# EAGLE design tick-display-mk-3 (EAGLE 6.5.0)
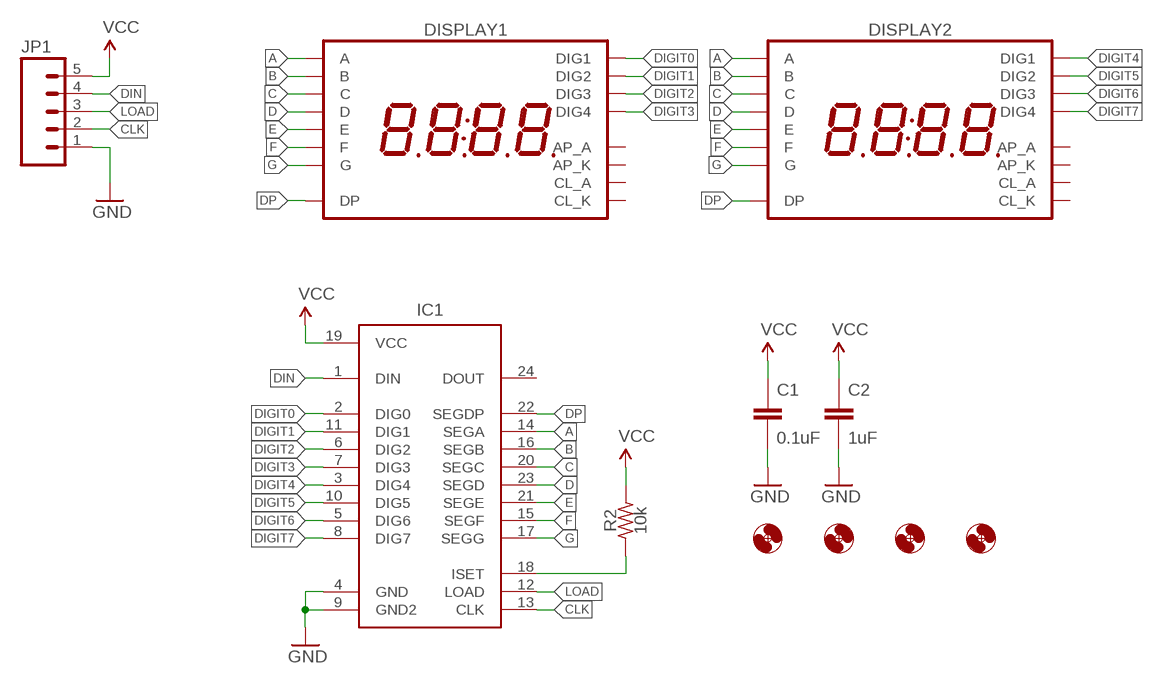
[diagram p0: schematic, sheet 1]

## Parts
C1  0.1uF  CAPACITOR-CERAMICC0805  [C0805]
C2  1uF  CAPACITOR-CERAMICC0805  [C0805]
DISPLAY1  7SEG_4DIGIT_10MM  [7SEG_4DIG_10MM]
DISPLAY2  7SEG_4DIGIT_10MM  [7SEG_4DIG_10MM]
H1  HOLE#2  [HOLE-#2]
H2  HOLE#2  [HOLE-#2]
H3  HOLE#2  [HOLE-#2]
H4  HOLE#2  [HOLE-#2]
IC1  MAX7219CWG  MAX7219SOIC-W  [SO24W]
JP1  M05JST-PH-RA-PTH  [JST-5-PH-RA-PTH]
R2  10k  RESISTORR0805  [R0805]

## Nets
A: DISPLAY1.14(A) DISPLAY2.14(A) IC1.14(SEGA)
B: DISPLAY1.16(B) DISPLAY2.16(B) IC1.16(SEGB)
C: DISPLAY1.13(C) DISPLAY2.13(C) IC1.20(SEGC)
CLK: IC1.13(CLK) JP1.2
D: DISPLAY1.3(D) DISPLAY2.3(D) IC1.23(SEGD)
DIGIT0: DISPLAY1.1(DIG1) IC1.2(DIG0)
DIGIT1: DISPLAY1.2(DIG2) IC1.11(DIG1)
DIGIT2: DISPLAY1.6(DIG3) IC1.6(DIG2)
DIGIT3: DISPLAY1.8(DIG4) IC1.7(DIG3)
DIGIT4: DISPLAY2.1(DIG1) IC1.3(DIG4)
DIGIT5: DISPLAY2.2(DIG2) IC1.10(DIG5)
DIGIT6: DISPLAY2.6(DIG3) IC1.5(DIG6)
DIGIT7: DISPLAY2.8(DIG4) IC1.8(DIG7)
DIN: IC1.1(DIN) JP1.4
DP: DISPLAY1.7(DP) DISPLAY2.7(DP) IC1.22(SEGDP)
E: DISPLAY1.5(E) DISPLAY2.5(E) IC1.21(SEGE)
F: DISPLAY1.11(F) DISPLAY2.11(F) IC1.15(SEGF)
G: DISPLAY1.15(G) DISPLAY2.15(G) IC1.17(SEGG)
GND: C1.2 C2.2 IC1.4(GND) IC1.9(GND2) JP1.1
LOAD: IC1.12(LOAD) JP1.3
N$2: IC1.18(ISET) R2.1
VCC: C1.1 C2.1 IC1.19(VCC) JP1.5 R2.2
Unconnected: DISPLAY1.4(CL_A) DISPLAY1.9(AP_K) DISPLAY1.10(AP_A) DISPLAY1.12(CL_K) DISPLAY2.4(CL_A) DISPLAY2.9(AP_K) DISPLAY2.10(AP_A) DISPLAY2.12(CL_K) IC1.24(DOUT)

## Library data of the parts
C1 C2 = A_butts:CAPACITOR-CERAMIC: CAPACITOR, European symbol
DISPLAY1 DISPLAY2 = A_butts:7SEG_4DIGIT_10MM
H1-H4 = A_butts:HOLE: MOUNTING HOLE with drill center marker
IC1 = A_butts:MAX7219: 8-digit, 8-segment LED display driver, serial input
JP1 = A_butts:M05: Header 5 Standard 5-pin 0.1" header. Use with straight break away headers (SKU : PRT-00116), right angle break away headers (PRT-00553), swiss pins (PRT-00743), machine pins (PRT-00117), and female headers (PRT-00115). Molex polarized connector foot print use with SKU : PRT-08230 with associated crimp pins and housings.
R2 = A_butts:RESISTOR: RESISTOR, American symbol

## Board
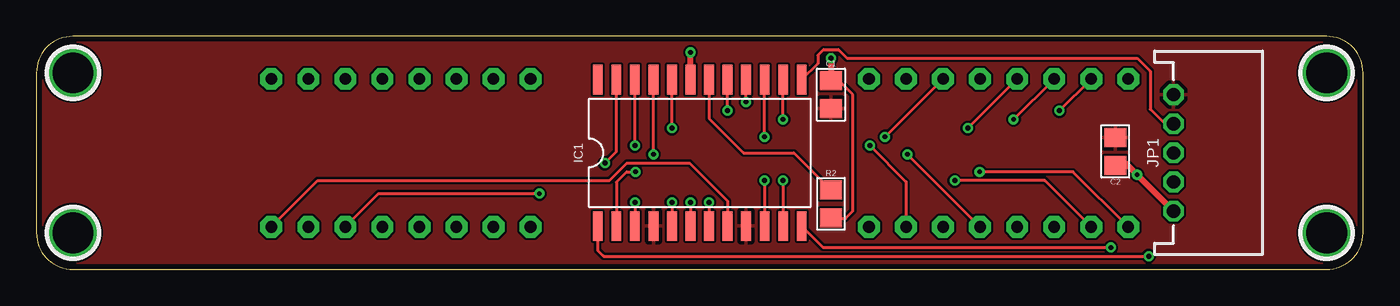
[diagram p1: board, top side]
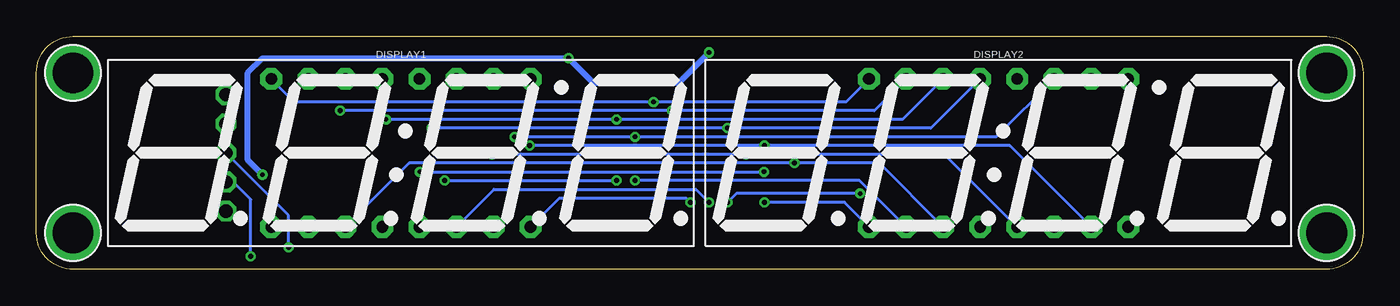
[diagram p2: board, bottom side, seen from below]

Size 91 x 16 mm. Coordinates in mm from the lower left corner, seen from the top.
Outline: 0,13.5 0,2.5 arc90 2.5,0 88.5,0 arc90 91,2.5 91,13.5 arc90 88.5,16 2.5,16 arc90 0,13.5
Copper layers (1*16): Top 0.0356mm / dielectric 1.5011mm / Bottom 0.0356mm
Design rules "LaenPCBOrder2": minimum track width 6mil, minimum drill 13mil, track to track 6mil, track to pad 6mil, pad to pad 6mil, via to via 6mil, smd to smd 6mil, copper to edge 15mil, drill to drill 6mil, minimum pad ring 7mil, minimum via ring 7mil, stop-mask expansion 3mil, vias tented up to drill 20mil, thermal gap 10mil

### Footprints (pad centres in the part's own frame; a part is rotated, then mirrored left to right if it is on the bottom)
C0805 = smd 1.3 x 1.5: 1 -0.95,0; 2 0.95,0
7SEG_4DIG_10MM = drill 0.8 pad 1.5 octagon: 1 -8.89,-5.08; 2 -6.35,-5.08; 3 -3.81,-5.08; 4 -1.27,-5.08; 5 1.27,-5.08; 6 3.81,-5.08; 7 6.35,-5.08; 8 8.89,-5.08; 9 8.89,5.08; 10 6.35,5.08; 11 3.81,5.08; 12 1.27,5.08; 13 -1.27,5.08; 14 -3.81,5.08; 15 -6.35,5.08; 16 -8.89,5.08
HOLE-#2 = drill 2.8 pad 3.81: P$1 0,0
SO24W = smd 0.66 x 2.032: 1 -6.985,-5.029; 2 -5.715,-5.029; 3 -4.445,-5.029; 4 -3.175,-5.029; 5 -1.905,-5.029; 6 -0.635,-5.029; 7 0.635,-5.029; 8 1.905,-5.029; 9 3.175,-5.029; 10 4.445,-5.029; 11 5.715,-5.029; 12 6.985,-5.029; 13 6.985,5.029; 14 5.715,5.029; 15 4.445,5.029; 16 3.175,5.029; 17 1.905,5.029; 18 0.635,5.029; 19 -0.635,5.029; 20 -1.905,5.029; 21 -3.175,5.029; 22 -4.445,5.029; 23 -5.715,5.029; 24 -6.985,5.029
JST-5-PH-RA-PTH = drill 0.9 pad 1.422 octagon: 1 -4,0; 2 -2,0; 3 0,0; 4 2,0; 5 4,0
R0805 = smd 1.3 x 1.5: 1 -0.95,0; 2 0.95,0

### Placement (x,y rotation side)
C1  54.5,12 270 top
C2  74,8.1 90 top
DISPLAY1  66,8 0 bottom
DISPLAY2  25,8 0 bottom
H1  88.5,13.5 0 top
H2  88.5,2.5 0 top
H3  2.5,2.5 0 top
H4  2.5,13.5 0 top
IC1  45.5,8 0 top
JP1  78,8 270 top
R2  54.5,4.5 270 top

### Tracks (layer width: path | path; a pad name or v marks a point on that pad's centre or on a via)
A  (via drill 0.33)
  Top 0.2: v67.03,10.3 DISPLAY1.14 | v51.22,10.3 IC1.14
  Bottom 0.2: DISPLAY2.14 31.59,10.3 v51.22,10.3 v67.03,10.3
B  (via drill 0.33)
  Top 0.2: v48.67,11.5 IC1.16
  Bottom 0.2: DISPLAY2.16 35.47,11.5 v48.67,11.5 73.31,11.5 DISPLAY1.16
C  (via drill 0.33)
  Top 0.2: v63.89,9.7 DISPLAY1.13 | v43.59,9.7 IC1.20
  Bottom 0.2: DISPLAY2.13 29.65,9.7 v43.59,9.7 v63.89,9.7
CLK
  Top 0.2: 52.5,13.04 IC1.13 53.6,14.14 53.6,14.7 54,15.1 55,15.1 55.6,14.5 75.5,14.5 76.4,13.6 76.4,11 77.4,10 JP1.2
D  (via drill 0.33)
  Top 0.2: v39,7.3 39.78,8.09 IC1.23
  Bottom 0.2: DISPLAY2.3 33.19,7.3 v39,7.3 65.43,7.3 DISPLAY1.3
DIGIT0  (via drill 0.33)
  Top 0.2: DISPLAY1.1 71.11,6.7 v64.7,6.7 | IC1.2 39.78,6 40.48,6.7 v41.09,6.7
  Bottom 0.2: v64.7,6.7 v41.09,6.7
DIGIT1  (via drill 0.33)
  Top 0.2: DISPLAY1.2 69.17,6.1 v63,6.1 | v51.22,6.1 IC1.11
  Bottom 0.2: v63,6.1 v51.22,6.1
DIGIT2  (via drill 0.33)
  Top 0.2: v44.87,4.6 IC1.6
  Bottom 0.2: DISPLAY1.6 59.61,5.5 45.77,5.5 v44.87,4.6
DIGIT3  (via drill 0.33)
  Top 0.2: v46.13,4.6 IC1.7
  Bottom 0.2: DISPLAY1.8 55.13,4.9 46.44,4.9 v46.13,4.6
DIGIT4  (via drill 0.33)
  Top 0.2: v41.05,4.6 IC1.3
  Bottom 0.2: DISPLAY2.1 35.57,4.6 v41.05,4.6
DIGIT5  (via drill 0.33)
  Top 0.2: v49.95,6.1 IC1.10
  Bottom 0.2: DISPLAY2.2 34.53,6.1 v49.95,6.1
DIGIT6  (via drill 0.33)
  Top 0.2: DISPLAY2.6 23.47,5.2 v34.5,5.2 | v43.59,4.6 IC1.5
  Bottom 0.2: v34.5,5.2 42.99,5.2 v43.59,4.6
DIGIT7
  Top 0.2: DISPLAY2.8 19.29,6.1 39.3,6.1 40.5,7.3 44.8,7.3 47.4,4.71 47.4,3.4 IC1.8
DIN  (via drill 0.33)
  Top 0.2: IC1.1 38.5,1.3 38.9,0.9 v76.3,0.9
  Bottom 0.2: v76.3,0.9 76.3,4.8 77.5,6 JP1.4
DP  (via drill 0.33)
  Top 0.2: v41.05,8.5 IC1.22 | v57.17,8.5 59.65,6.02 DISPLAY1.7
  Bottom 0.2: DISPLAY2.7 24.23,8.5 v41.05,8.5 v57.17,8.5
E  (via drill 0.33)
  Top 0.2: v59.75,7.9 DISPLAY1.5 | v42.33,7.9 IC1.21
  Bottom 0.2: DISPLAY2.5 28.71,7.9 v42.33,7.9 v59.75,7.9
F  (via drill 0.33)
  Top 0.2: v58.21,9.1 DISPLAY1.11 | v49.95,9.1 IC1.15
  Bottom 0.2: DISPLAY2.11 25.17,9.1 v49.95,9.1 v58.21,9.1
G  (via drill 0.33)
  Top 0.2: v70.17,10.9 DISPLAY1.15 | v47.41,10.9 IC1.17
  Bottom 0.2: DISPLAY2.15 33.53,10.9 v47.41,10.9 v70.17,10.9
GND
  pour Top: 2.5,16 88.5,16 arc-90 91,13.5 91,2.5 arc-90 88.5,0 2.5,0 arc-90 0,2.5 0,13.5 arc-90
LOAD  (via drill 0.33)
  Top 0.2: IC1.12 53.96,1.5 v73.7,1.5
  Bottom 0.2: v73.7,1.5 73.7,3.7 JP1.3
N$2
  Top 0.2: IC1.18 46.13,10.37 48.5,8 51.95,8 R2.1
VCC  (via drill 0.33)
  Top 0.2: R2.2 54.55,3.5 55.5,3.5 56,4 56,12 55.05,12.95 C1.1
  Top 0.4: v54.5,14.5 C1.1 | IC1.19 v44.87,14.9 | C2.1 74.15,7.3 74.7,7.3 v75.5,6.5 JP1.5
  Bottom 0.4: v44.87,14.9 46.97,12.8 52.8,12.8 v54.5,14.5 75.5,14.5 76.5,13.5 76.5,7.5 v75.5,6.5